# Altium schematic sheet 3.3VTo5V.SchDoc
size A4
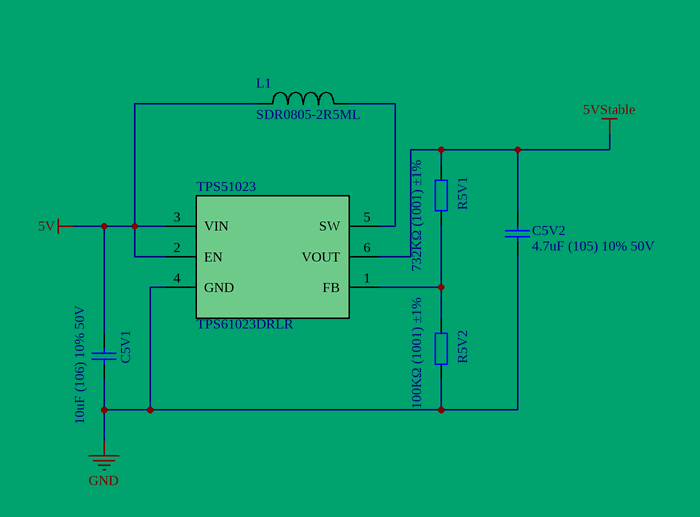
[diagram p0: 3.3VTo5V.SchDoc]

## Parts
C5V1  10uF (106) 10% 50V  [1206_C]
C5V2  4.7uF (105) 10% 50V  [1206_C]
L1  SDR0805-2R5ML  [SDR0805]
R5V1  732KΩ (1001) ±1%  [1206_R]
R5V2  100KΩ (1001) ±1%  [1206_R]
TPS51023  TPS61023DRLR  [DRL0006A]

## Nets
5V: C5V1.2 L1.1 TPS51023.2(EN) TPS51023.3(VIN)
5VStable: C5V2.2 R5V1.2 TPS51023.6(VOUT)
GND: C5V1.1 C5V2.1 R5V2.1 TPS51023.4(GND)
NetL1_2: L1.2 TPS51023.5(SW)
NetR5V1_1: R5V1.1 R5V2.2 TPS51023.1(FB)

## Library data of the parts
C5V1 = 1206 10uF (106) 10% 50V: 贴片电容; ComponentLink1Description: 供应商链接; ComponentLink1URL: http://www.szlcsc.com/product/details_14236.html; Package: 1206; Supplier: LC; SuppliersPartNumber: C13585
C5V2 = 1206 1uF (105) 10% 50V: 贴片电容; ComponentLink1Description: 供应商链接; ComponentLink1URL: http://www.szlcsc.com/product/details_2200.html; Package: 1206; Supplier: LC; SuppliersPartNumber: C1848
L1 = SDR0805-2R5ML: Imported; Vendor: Bourns; Type: DEV; Manufacturer_Part_Number: SDR0805-2R5ML; Manufacturer_Name: Bourns; RefDes: RefDes; Value: Value
R5V1 R5V2 = 1206 1KΩ (1001) 1%: 贴片电阻; ComponentLink1Description: 供应商链接; ComponentLink1URL: http://www.szlcsc.com/product/details_4817.html; Package: 1206; Supplier: LC; SuppliersPartNumber: C4410
TPS51023 = TPS61023DRLR: Imported; Manufacturer: Texas Instruments; PartNumber: TPS61023DRL; RefDes: RefDes; Type: DEV; Value: Value; Manufacturer_Part_Number: TPS61023DRLR; Manufacturer_Name: Texas Instruments